# EAGLE design ESP32 (EAGLE 9.6.2)
DESCRIPTION: microOBD 200 OBD-II Module; HW_REV: 1.4; PCB_REV: C; PCB_SPEC1: Layer Count: 4; PCB_SPEC2: Size: 1.3" x 0.59"; PCB_SPEC3: Finish Thickness: 0.049" - 0.052"; PCB_SPEC4: Copper Weight: 1oz; TITLE: STM1120
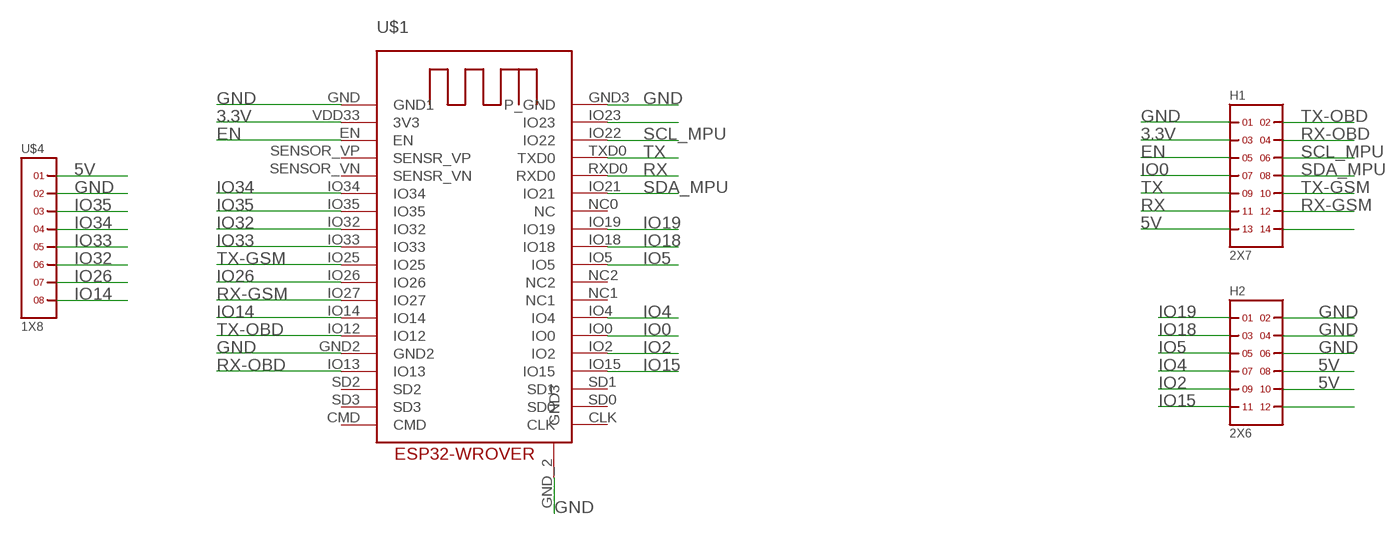
[diagram p0: schematic, sheet 1]

## Parts
H1  2X7  [2X7]
H2  2X6  [2X6]
U$1  ESP32-WROVER  [ESP32-WROVER]
U$4  1X8  [1X8]

## Nets
3.3V [highpower]: H1.3 U$1.VDD33(3V3)
5V [highpower]: H1.13 H2.8 H2.10 U$4.1
EN [highpower]: H1.5 U$1.EN
GND: H1.1 H2.2 H2.4 H2.6 U$1.GND2 U$1.GND3(P_GND) U$1.GND(GND1) U$1.GND_2(GND3) U$4.2
IO0: H1.7 U$1.IO0
IO2: H2.9 U$1.IO2
IO4: H2.7 U$1.IO4
IO5: H2.5 U$1.IO5
IO14: U$1.IO14 U$4.8
IO15: H2.11 U$1.IO15
IO18: H2.3 U$1.IO18
IO19: H2.1 U$1.IO19
IO26: U$1.IO26 U$4.7
IO32: U$1.IO32 U$4.6
IO33: U$1.IO33 U$4.5
IO34: U$1.IO34 U$4.4
IO35: U$1.IO35 U$4.3
N$22: H1.14
N$28: H2.12
N$51: U$1.IO23
RX: H1.11 U$1.RXD0
RX-GSM: H1.12 U$1.IO27
RX-OBD: H1.4 U$1.IO13
SCL_MPU: H1.6 U$1.IO22
SDA_MPU: H1.8 U$1.IO21
TX: H1.9 U$1.TXD0
TX-GSM: H1.10 U$1.IO25
TX-OBD: H1.2 U$1.IO12
Unconnected: U$1.CLK U$1.CMD U$1.NC0(NC) U$1.NC1 U$1.NC2 U$1.SD0 U$1.SD1 U$1.SD2 U$1.SD3 U$1.SENSOR_VN(SENSR_VN) U$1.SENSOR_VP(SENSR_VP)

## Library data of the parts
H1 = headers(.1in):2X7
H2 = headers(.1in):2X6
U$1 = ESP32-Wrover:ESP32-WROVER
U$4 = headers(2mm):1X8

## Net classes
1 highpower: width 0.305 mm

## Board
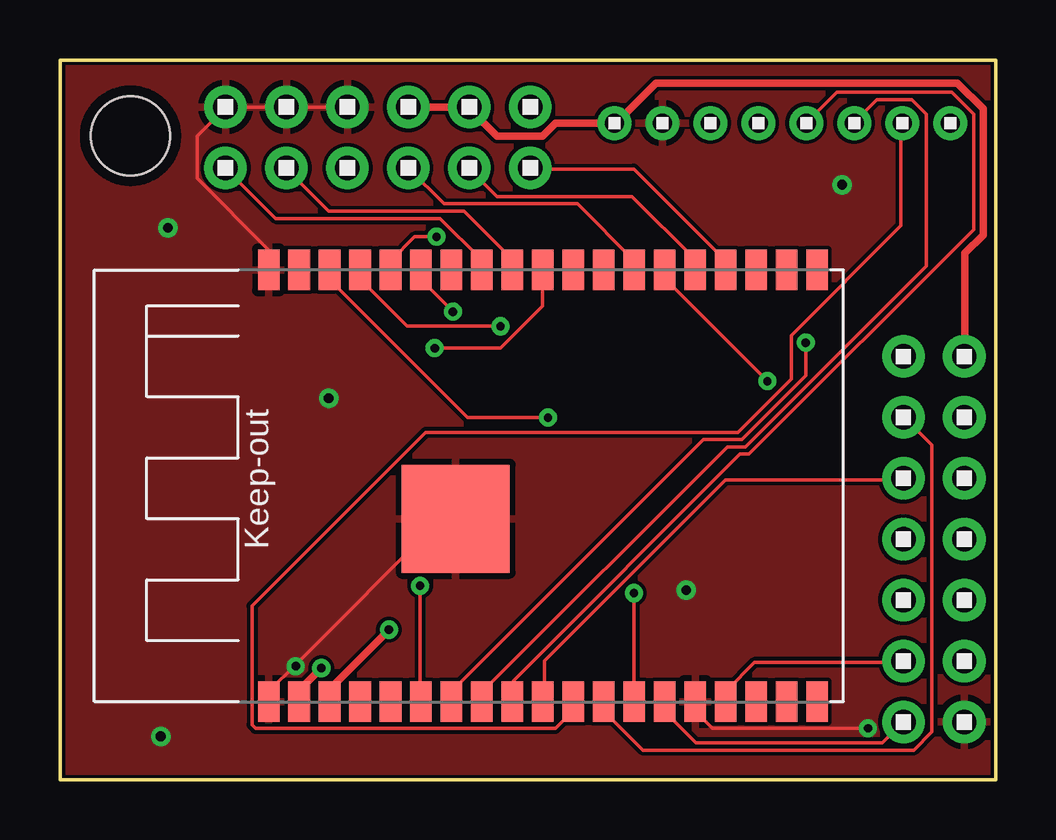
[diagram p1: board, top side]
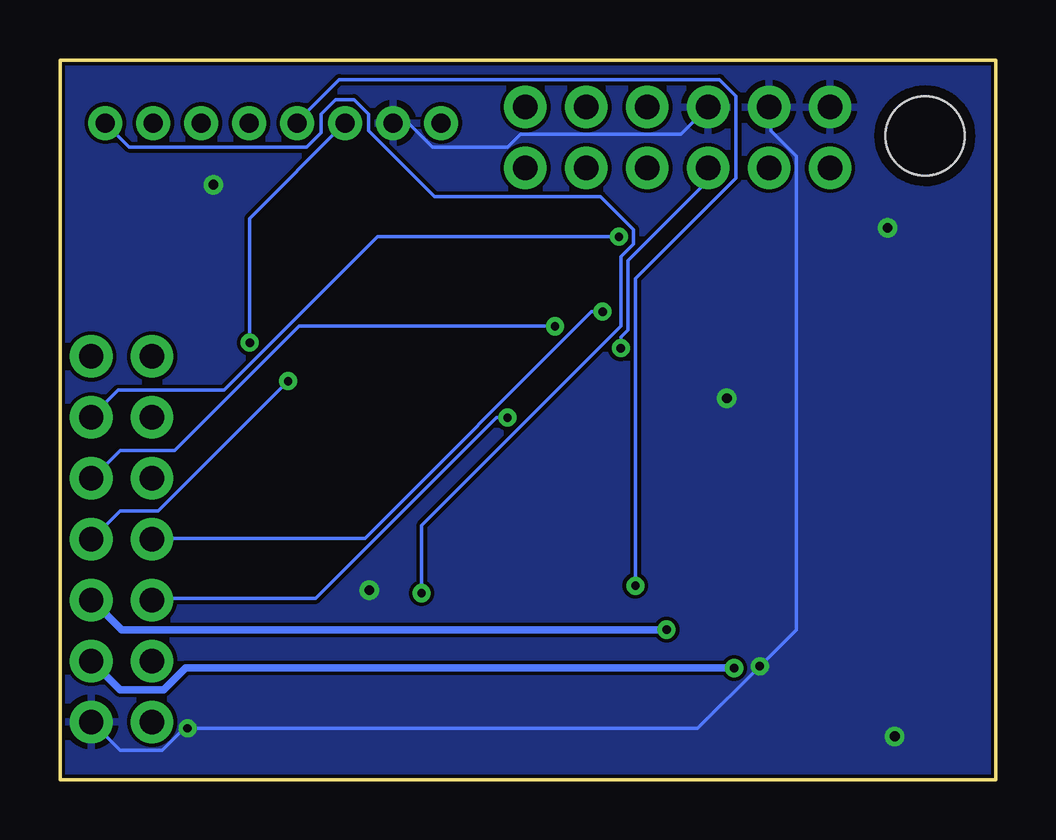
[diagram p2: board, bottom side, seen from below]

Size 39 x 30 mm. Coordinates in mm from the lower left corner, seen from the top.
Outline: 0,0 39,0 39,30 0,30 0,0
Copper layers (1*16): Top 0.035mm / dielectric 1.5mm / Bottom 0.035mm
Design rules "default *": minimum track width 6mil, minimum drill 0.35mm, track to track 6mil, track to pad 6mil, pad to pad 6mil, via to via 6mil, smd to smd 6mil, copper to edge 8mil, drill to drill 8mil, minimum pad ring 10mil, minimum via ring 8mil, stop-mask expansion 4mil, vias tented up to drill 0mil, thermal gap 10mil
Milling: 4 lines

### Footprints (pad centres in the part's own frame; a part is rotated, then mirrored left to right if it is on the bottom)
2X7 = drill 1.016 pad 1.778: 1 0,0; 2 0,2.54; 3 2.54,0; 4 2.54,2.54; 5 5.08,0; 6 5.08,2.54; 7 7.62,0; 8 7.62,2.54; 9 10.16,0; 10 10.16,2.54; 11 12.7,0; 12 12.7,2.54; 13 15.24,0; 14 15.24,2.54
2X6 = drill 1.016 pad 1.778: 1 0,0; 2 0,2.54; 3 2.54,0; 4 2.54,2.54; 5 5.08,0; 6 5.08,2.54; 7 7.62,0; 8 7.62,2.54; 9 10.16,0; 10 10.16,2.54; 11 12.7,0; 12 12.7,2.54
STAND-OFF = hole 3.302: 0,0
ESP32-WROVER = smd 1.7 x 0.9: CLK 18,1.27; CMD 0,1.27; EN 0,21.59; GND 0,24.13; GND3 18,24.13; GND_2 0,6.35; IO0 18,7.62; IO2 18,6.35; IO4 18,8.89; IO5 18,12.7; IO12 0,7.62; IO13 0,5.08; IO14 0,8.89; IO15 18,5.08; IO18 18,13.97; IO19 18,15.24; IO21 18,17.78; IO22 18,21.59; IO23 18,22.86; IO25 0,12.7; IO26 0,11.43; IO27 0,10.16; IO32 0,15.24; IO33 0,13.97; IO34 0,17.78; IO35 0,16.51; NC0 18,16.51; NC1 18,10.16; NC2 18,11.43; RXD0 18,19.05; SD0 18,2.54; SD1 18,3.81; SD2 0,3.81; SD3 0,2.54; SENSOR_VN 0,19.05; SENSOR_VP 0,20.32; TXD0 18,20.32; VDD33 0,22.86 | smd 4.5 x 4.5: GND2 7.62,16.34
1X8 = drill 0.8 pad 1.422: 1 -7,0; 2 -5,0; 3 -3,0; 4 -1,0; 5 1,0; 6 3,0; 7 5,0; 8 7,0

### Placement (x,y rotation side)
H1  37.7,2.4 90 top
H2  6.9,25.5 0 top
JP4  STAND-OFF  [STAND-OFF]  2.94,26.84 0 top
U$1  32.83,3.25 90 top
U$4  30.11,27.37 0 top

### Tracks (layer width: path | path; a pad name or v marks a point on that pad's centre or on a via)
3.3V  (via drill 0.35)
  Top 0.305: v10.9,4.65 9.98,3.73 9.98,3.28 U$1.VDD33
  Bottom 0.305: v10.9,4.65 33.76,4.65 34.67,3.73 36.5,3.73 37.64,4.88 H1.3
5V
  Top 0.305: H1.13 37.72,17.68 37.72,21.95 38.48,22.71 38.48,27.96 37.41,29.03 24.84,29.03 23.24,27.43 U$4.1 23.09,27.36 20.65,27.36 20.12,26.82 18.21,26.82 17.07,27.96 H2.10 16.92,28.04 14.55,28.04 H2.8
EN  (via drill 0.35)
  Top 0.305: v13.72,6.25 11.28,3.81 11.28,3.28 U$1.EN
  Bottom 0.305: v13.72,6.25 36.42,6.25 37.64,7.47 H1.5
GND  (via drill 0.35, 0.41)
  Top 0.152: U$1.GND3 8.69,21.26 8.69,22.1 5.71,25.07 5.71,26.82 6.86,27.96 H2.2 6.93,28.04 9.37,28.04 H2.4 11.96,28.04 H2.6 | v33.68,2.13 27.2,2.13 26.52,2.82 26.52,3.2 U$1.GND_2 | 9.79,4.76 15.85,10.82 16.46,10.82 U$1.GND2 | 9.79,4.76 8.76,3.73 8.76,3.28 U$1.GND | v9.83,4.72 9.79,4.76
  Bottom 0.152: U$4.2 25.07,27.36 24.46,27.36 23.47,26.36 20.34,26.36 19.81,26.9 13.11,26.9 12.04,27.96 H2.6 | H1.1 37.64,2.36 36.5,1.22 34.75,1.22 33.83,2.13 v33.68,2.13 12.42,2.13 v9.83,4.72 8.31,6.25 8.31,25.98 9.37,27.05 9.37,27.96 H2.4
  other vias: 4.5,23 11.2,15.9 4.2,1.8 32.6,24.8 26.1,7.9
  pour Top (isolate 0.15): -2.7,-0.3 -2.7,29.7 -0.2,32.2 39,32.2 40.8,30.4 41.6,29.6 41.6,-0.2 38.8,-3 35.8,-3 -0.3,-3 -2.7,-0.6
  pour Bottom (isolate 0.15): -2.8,-0.9 -3.7,0 -3.7,30.4 -2.1,32 -0.3,32 39.7,32 40.9,30.8 42,29.7 42,2 42,-0.1 39.5,-2.6 39.1,-3 1.8,-3 -0.7,-3
IO0  (via drill 0.35)
  Top 0.152: v29.49,16.61 25.22,20.88 25.22,21.18 U$1.IO0
  Bottom 0.152: v29.49,16.61 34.9,11.2 36.5,11.2 37.64,10.06 H1.7
IO2
  Top 0.152: U$1.IO2 26.44,21.26 26.44,21.72 23.85,24.31 18.21,24.31 17.07,25.45 H2.9
IO4
  Top 0.152: U$1.IO4 23.93,21.26 23.93,21.64 21.57,24 16,24 14.55,25.45 H2.7
IO5  (via drill 0.35)
  Top 0.152: v15.62,17.98 18.36,17.98 20.12,19.74 20.12,21.18 U$1.IO5
  Bottom 0.152: v15.62,17.98 15.62,18.44 15.32,18.75 15.32,21.64 12.04,24.92 12.04,25.45 H2.5
IO14  (via drill 0.35)
  Top 0.152: v23.93,7.77 23.93,3.28 U$1.IO14
  Bottom 0.152: v23.93,7.77 23.93,10.59 15.62,18.9 15.62,21.79 15.09,22.33 15.09,22.94 16.46,24.31 23.39,24.31 26.14,27.05 26.14,27.74 26.75,28.35 27.51,28.35 28.12,27.74 28.12,26.98 28.73,26.36 36.12,26.36 37.11,27.36 U$4.8
IO15
  Top 0.152: U$1.IO15 27.74,21.26 27.74,21.64 23.93,25.45 19.66,25.45 H2.11
IO18
  Top 0.152: U$1.IO18 18.82,21.26 18.82,21.72 16.84,23.7 11.2,23.7 9.45,25.45 H2.3
IO19
  Top 0.152: U$1.IO19 17.53,21.26 17.53,21.72 15.85,23.39 8.99,23.39 6.93,25.45 H2.1
IO26
  Top 0.152: U$1.IO26 21.34,3.2 21.34,2.82 20.65,2.13 8.15,2.13 8,2.29 8,7.24 15.24,14.48 28.27,14.48 30.48,16.69 30.48,18.52 35.05,23.09 35.05,27.36 U$4.7
IO32
  Top 0.152: U$1.IO32 17.6,3.28 17.6,3.66 27.81,13.87 28.57,13.87 36.12,21.41 36.12,27.74 35.51,28.35 34.06,28.35 33.15,27.43 U$4.6
IO33
  Top 0.152: U$1.IO33 18.9,3.28 18.9,4.12 28.35,13.56 28.73,13.56 38.1,22.94 38.1,27.74 37.19,28.65 32.38,28.65 31.17,27.43 U$4.5
IO34  (via drill 0.35)
  Top 0.152: v15.01,8.08 15.01,3.28 U$1.IO34
  Bottom 0.152: v15.01,8.08 15.01,20.88 10.82,25.07 10.82,28.5 11.51,29.18 27.36,29.18 29.11,27.43 U$4.4
IO35  (via drill 0.35)
  Top 0.152: v31.09,18.21 31.09,16.84 28.42,14.17 26.82,14.17 16.38,3.73 16.38,3.28 U$1.IO35
  Bottom 0.152: v31.09,18.21 31.09,23.39 27.13,27.36 U$4.3
RX  (via drill 0.35)
  Top 0.152: v15.7,22.63 14.78,22.63 13.79,21.64 13.79,21.26 U$1.RXD0
  Bottom 0.152: v15.7,22.63 25.76,22.63 32.16,16.23 36.58,16.23 37.64,15.16 H1.11
RX-GSM
  Top 0.152: U$1.IO27 22.71,3.2 22.71,2.82 24.31,1.22 35.59,1.22 36.35,1.98 36.35,13.95 35.2,15.09 H1.12
RX-OBD
  Top 0.152: U$1.IO13 27.81,3.28 27.81,3.73 28.96,4.88 35.13,4.88 H1.4
SCL_MPU  (via drill 0.35)
  Top 0.152: v20.34,15.09 16.99,15.09 11.28,20.8 11.28,21.18 U$1.IO22
  Bottom 0.152: v20.34,15.09 20.8,15.09 28.35,7.54 35.13,7.54 H1.6
SDA_MPU  (via drill 0.35)
  Top 0.152: v16.38,19.51 15.09,20.8 15.09,21.18 U$1.IO21
  Bottom 0.152: v16.38,19.51 16.84,19.51 26.29,10.06 35.13,10.06 H1.8
TX  (via drill 0.35)
  Top 0.152: v18.36,18.9 14.48,18.9 12.57,20.8 12.57,21.18 U$1.TXD0
  Bottom 0.152: v18.36,18.9 29.03,18.9 34.21,13.72 36.5,13.72 37.64,12.57 H1.9
TX-GSM
  Top 0.152: U$1.IO25 20.19,3.28 20.19,4.95 27.74,12.5 35.13,12.5 H1.10
TX-OBD
  Top 0.152: U$1.IO12 25.22,3.2 25.22,2.82 26.52,1.52 34.29,1.52 35.13,2.36 H1.2